# EasyEDA Pro project solorTraker.eprj

# Schematic Schematic1
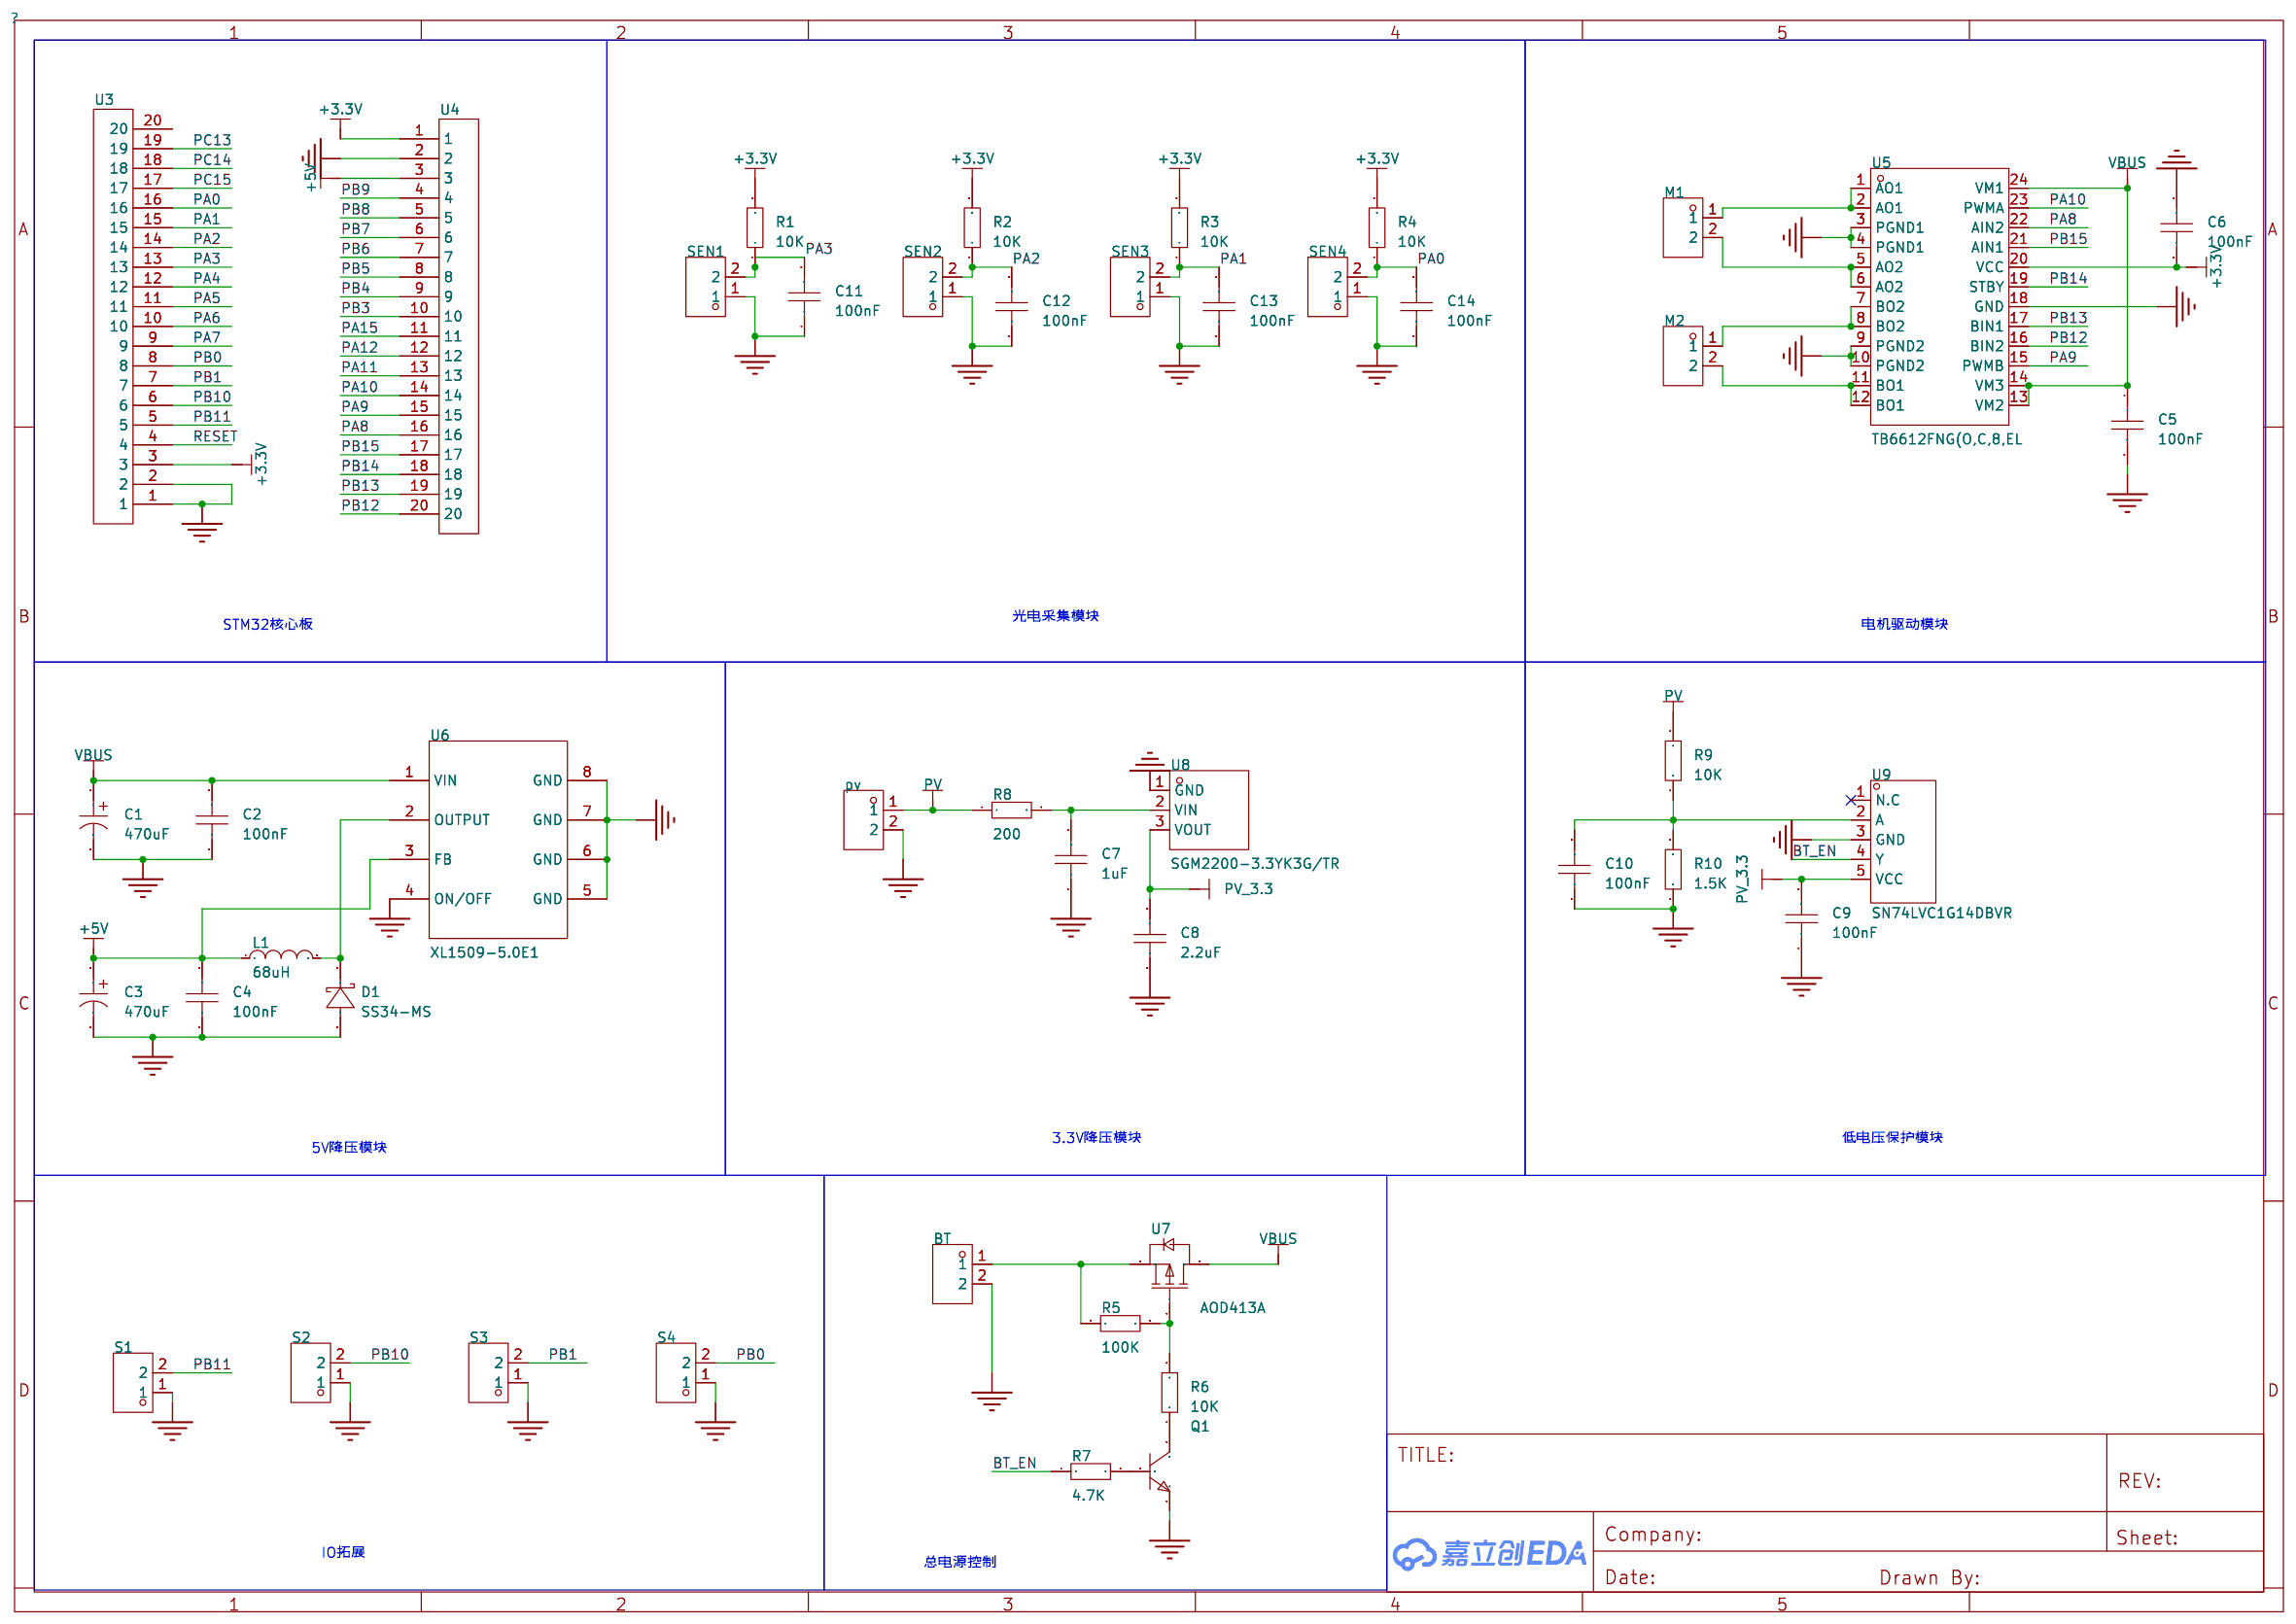
[diagram p0: schematic sheet]

## Parts
BT  KF350-3.5-2P  [CONN-TH_P3.50_KF350-3.5-2P]
C1  470uF  [CAP-SMD_BD10.0-L10.3-W10.3-LS11.0-FD]
C2  100nF  [C0603]
C3  470uF  [CAP-SMD_BD6.3-L6.6-W6.6-LS7.6-RD]
C4  100nF  [C0603]
C5  100nF  [C0603]
C6  100nF  [C0603]
C7  1uF  [C0603]
C8  2.2uF  [C0603]
C9  100nF  [C0603]
C10  100nF  [C0603]
C11  100nF  [C0603]
C12  100nF  [C0603]
C13  100nF  [C0603]
C14  100nF  [C0603]
D1  SS34-MS  [DO-214AC_L4.3-W2.7-LS5.0-RD]
L1  68uH  [IND-SMD_L11.5-W10.0_104CDMCCDS]
M1  ZX-XH2.54-2PZZ  [CONN-TH_2P-P2.50_HX25003-2A]
M2  ZX-XH2.54-2PZZ  [CONN-TH_2P-P2.50_HX25003-2A]
pv  ZX-XH2.54-2PZZ  [CONN-TH_2P-P2.50_HX25003-2A]
Q1  -  [S8050_SOT-23]
R1  10K  [R0603]
R2  10K  [R0603]
R3  10K  [R0603]
R4  10K  [R0603]
R5  100K  [R0603]
R6  10K  [R0603]
R7  4.7K  [R0603]
R8  200  [R0805]
R9  10K  [R0603]
R10  1.5K  [R0603]
S1  ZX-XH2.54-2PZZ  [CONN-TH_2P-P2.50_HX25003-2A]
S2  ZX-XH2.54-2PZZ  [CONN-TH_2P-P2.50_HX25003-2A]
S3  ZX-XH2.54-2PZZ  [CONN-TH_2P-P2.50_HX25003-2A]
S4  ZX-XH2.54-2PZZ  [CONN-TH_2P-P2.50_HX25003-2A]
SEN1  ZX-XH2.54-2PZZ  [CONN-TH_2P-P2.50_HX25003-2A]
SEN2  ZX-XH2.54-2PZZ  [CONN-TH_2P-P2.50_HX25003-2A]
SEN3  ZX-XH2.54-2PZZ  [CONN-TH_2P-P2.50_HX25003-2A]
SEN4  ZX-XH2.54-2PZZ  [CONN-TH_2P-P2.50_HX25003-2A]
U3  -  [HDR1X20]
U4  -  [HDR1X20]
U5  TB6612FNG(O,C,8,EL  [SSOP-24_L8.4-W5.8-P0.65-LS7.8-BL]
U6  XL1509-5.0E1  [SOIC-8_L5.0-W4.0-P1.27-LS6.0-BL]
U7  AOD413A  [TO-252-2_L6.6-W6.1-P4.58-LS10.1-BR-CW]
U8  SGM2200-3.3YK3G/TR  [SOT-89-3_L4.5-W2.5-P1.50-LS4.2-BR]
U9  SN74LVC1G14DBVR  [SOT-23-5_L3.0-W1.7-P0.95-LS2.8-BR]

## Library data of the parts
BT = KF350-3.5-2P: 结构:1x2P;间距:3.5mm;颜色:绿色;安装方式:直插;额定电流:10A;额定电压:300V;排数:1;线规 - AWG:18~24;线规 - 平方毫米:0.75;每排PIN数:2;工作温度范围:-40℃~+105℃;; LCSC Part Name: 3.5mm 1x2P 排数:1 每排P数:2 直插; Supplier Part: C474892; Manufacturer: KEFA(科发); Supplier Footprint: 插件,P=3.5mm; JLCPCB Part Class: 扩展库; Datasheet: https://atta.szlcsc.com/upload/public/pdf/source/20230317/986DB56DD49619EA586AA8816AA9D164.pdf; Supplier: LCSC; Structure: 1x2P; Pitch: 3.5mm; Color: 绿色; Mounting Style: 直插; Current Rating (Max): 10A; Voltage Rating (Max): 300V; Number of Pins: 2P; Number of Rows: 1; Wire Gauge - AWG: 18~24; Wire Gauge - mm2: 0.75; Number of PINs Per Row: 2; Operating Temperature Range: -40℃~+105℃
C1 = RVT470UF35V67RV0056: 容值:470uF;精度:±20%;额定电压:35V;纹波电流:286mA@120Hz;等效串联电阻:-;; LCSC Part Name: 470uF ±20% 35V; Supplier Part: C2836436; Manufacturer: KNSCHA(科尼盛); Supplier Footprint: SMD,D10xL10.2mm; JLCPCB Part Class: 扩展库; Datasheet: https://atta.szlcsc.com/upload/public/pdf/source/20210528/C2836436_C8D3EEA5E3C1CA7F9FA48FC22CF12531.pdf; Supplier: LCSC; Tolerance: ±20%; Rated Voltage: 35V; Ripple Current: 286mA@120Hz; φD: 10mm; L: 10.2mm; Lifetime @ Temp: 2000hrs@105℃; Operating Temperature: -55℃~+105℃
C2 C4-C14 = CAP_0603: Supplier Footprint: 0603
C3 = RVT1C471M0607: 容值:470uF;精度:±20%;额定电压:16V;纹波电流:185mA@120Hz;; LCSC Part Name: 470uF ±20% 16V; Supplier Part: C2977552; Manufacturer: ROQANG(容强); Supplier Footprint: SMD,D6.3xL7.7mm; JLCPCB Part Class: 扩展库; Datasheet: https://atta.szlcsc.com/upload/public/pdf/source/20220223/DD822675CC1DF2F0C06D5C2255C9C2D9.pdf; Supplier: LCSC; Tolerance: ±20%; Rated Voltage: 16V; Ripple Current: 185mA@120Hz; φD: 6.3mm; L: 7.7mm; Lifetime @ Temp: 2000hrs@105℃; Operating Temperature: -40℃~+105℃
D1 = SS34-MS: 二极管配置:-;正向压降(Vf):550mV@3A;直流反向耐压(Vr):40V;平均整流电流(Io):3A;; LCSC Part Name: 电压:40V 电流:3A; Supplier Part: C2836396; Manufacturer: MSKSEMI(美森科); Supplier Footprint: SMA(DO-214AC); JLCPCB Part Class: 扩展库; Datasheet: https://atta.szlcsc.com/upload/public/pdf/source/20231010/B8429D209A8A83BAE11971393C9E7848.pdf; Supplier: LCSC; Forward Voltage (Vf@If): 550mV@3A; Reverse Voltage (Vr): 40V; Average Rectified Current (Io): 3A; Reverse Leakage Current (Ir): 500uA@40V
L1 = FXL1040-680-M: 电感值:68uH;精度:±20%;额定电流:2.5A;饱和电流(Isat):3A;类型:一体成型电感;; LCSC Part Name: 68uH ±20% 3A; Supplier Part: C475920; Manufacturer: cjiang(长江微电); Supplier Footprint: SMD,11.5x10mm; JLCPCB Part Class: 扩展库; Datasheet: https://atta.szlcsc.com/upload/public/pdf/source/20230516/54757DC4DB76FADFA619F78143C06647.pdf; Supplier: LCSC; Tolerance: ±20%; Rated Current: 2.5A; Saturation Current (Isat): 3A; DC Resistance (DCR): 195mΩ; Type: 一体成型电感
M1 M2 pv S1-S4 SEN1-SEN4 = ZX-XH2.54-2PZZ: 插针结构:1x2P;间距:2.54mm;安装方式:直插;参考系列:XH;总PIN数:2P;排数:1;每排PIN数:2;行距:-;额定电流:3A;触头材质:黄铜;触头镀层:锡;工作温度范围:-25℃~+85℃;; Supplier Part: C7429632; Manufacturer: Megastar(兆星); Supplier Footprint: 插件,P=2.54mm; JLCPCB Part Class: 扩展库; Datasheet: https://atta.szlcsc.com/upload/public/pdf/source/20230619/19BA6947230AA44A04D3EDD65E618FD0.pdf; Supplier: LCSC; Pins Structure: 1x2P; Pitch: 2.54mm; Mounting Style: 直插; Reference Series: XH; Number of Pins: 2P; Number of Rows: 1; Number of PINs Per Row: 2; Current Rating (Max): 3A; Contact Material: 黄铜; Contact Plating: 锡; Operating Temperature Range: -25℃~+85℃
Q1 = S8050_SOT_NPN: Supplier Footprint: SOT-23
R1-R7 R9 R10 = Res_0603: Supplier Footprint: 0603
R8 = Res_0805: Supplier Footprint: 0805
U3 U4 = 1X20
U5 = TB6612FNG(O,C,8,EL: 双直流电机驱动器集成电路; Supplier Part: C88224; Manufacturer: TOSHIBA(东芝); Supplier Footprint: SSOP-24-208mil; JLCPCB Part Class: 扩展库; Datasheet: https://atta.szlcsc.com/upload/public/pdf/source/20171128/C141517_15118625624231147036.pdf; Supplier: LCSC
U6 = XL1509-5.0E1: 功能类型:降压型;输入电压:-;输出电流(最大值):-;; Supplier Part: C61063; Manufacturer: XLSEMI(芯龙); Supplier Footprint: SOIC-8; JLCPCB Part Class: 基础库; Datasheet: https://atta.szlcsc.com/upload/public/pdf/source/20151126/1457707596805.pdf; Supplier: LCSC; Function: 降压型; Switch tube (built-in/external): 内置
U7 = AOD413A_C5261059: 类型:P沟道;漏源电压(Vdss):40V;连续漏极电流(Id):25A;功率(Pd):8W;导通电阻(RDS(on)@Vgs,Id):44mΩ@4.5V;阈值电压(Vgs(th)@Id):2.5V@250uA;; LCSC Part Name: P沟道 耐压:40V 电流:25A; Supplier Part: C5261059; Manufacturer: HXY MOSFET(华轩阳电子); Supplier Footprint: TO-252-2L; JLCPCB Part Class: 扩展库; Datasheet: https://atta.szlcsc.com/upload/public/pdf/source/20221111/DEFC72396C0221D22120D4BE27CE7200.pdf; Supplier: LCSC; Type: P沟道; Drain Source Voltage (Vdss): 40V; Continuous Drain Current (Id): 25A; Power Dissipation (Pd): 8W; Drain Source On Resistance (RDS(on)@Vgs,Id): 44mΩ@4.5V; Gate Threshold Voltage (Vgs(th)@Id): 2.5V@250uA; Input Capacitance (Ciss@Vds): 1.034nF
U8 = SGM2200-3.3YK3G/TR: Supplier Part: C80929; Manufacturer: SGMICRO(圣邦微); Supplier Footprint: SOT-89-3; JLCPCB Part Class: Extended Part; Datasheet: https://atta.szlcsc.com/upload/public/pdf/source/20180326/C80929_E236534340D5DB25B3096B98A8E77889.pdf; Supplier: LCSC
U9 = SN74LVC1G14DBVR: 输入类型:施密特触发器;电源电压:1.65V~5.5V;供电电流(最大值):10uA;电路数:1;最大传播延迟(tpd):6.5ns@2.5V,50pF;; LCSC Part Name: 单路施密特触发反相器; Supplier Part: C7835; Manufacturer: TI(德州仪器); Supplier Footprint: SOT-23-5; JLCPCB Part Class: 扩展库; Datasheet: https://www.ti.com/cn/lit/gpn/sn74lvc1g14; Supplier: LCSC; Input Type: 施密特触发器; Supply Voltage(Single): 1.65V~5.5V; Supply Current (Max): 10uA; Number of Circuits: 1; Number of Inputs: 1; Sink Current: 32mA; Source Current: 32mA; High level range (VIH): 1.16V~3.33V; Low level range (VIL): 390mV~1.87V; Max Propagation Delay: 6.5ns@2.5V,50pF; Series: 74LVC系列; Operating Temperature: -40℃~+125℃

## Nets
+3.3V: C6.2 R1.2 R2.2 R3.2 R4.2 U3.3 U4.1 U5.20(VCC)
+5V: C3.1 C4.2 L1.1 U4.3 U6.3(FB)
GND: BT.2 C1.2 C2.1 C3.2 C4.1 C5.2 C6.1 C7.1 C8.1 C9.1 C10.1 C11.1 C12.1 C13.1 C14.1 D1.2(K) pv.2 Q1.2 R10.1 S1.1 S2.1 S3.1 S4.1 SEN1.1 SEN2.1 SEN3.1 SEN4.1 U3.1 U3.2 U4.2 U5.3(PGND1) U5.4(PGND1) U5.9(PGND2) U5.10(PGND2) U5.18(GND) U6.4(ON/OFF) U6.5(GND) U6.6(GND) U6.7(GND) U6.8(GND) U8.1(GND) U9.3(GND)
VBUS: C1.1 C2.2 C5.1 U5.13(VM2) U5.14(VM3) U5.24(VM1) U6.1(VIN) U7.2(D)
BT_EN: R7.1 U9.4(Y)
PA0: C14.2 R4.1 SEN4.2 U3.16
PA1: C13.2 R3.1 SEN3.2 U3.15
PA2: C12.2 R2.1 SEN2.2 U3.14
PA3: C11.2 R1.1 SEN1.2 U3.13
PA4: U3.12
PA5: U3.11
PA6: U3.10
PA7: U3.9
PA8: U4.16 U5.22(AIN2)
PA9: U4.15 U5.15(PWMB)
PA10: U4.14 U5.23(PWMA)
PA11: U4.13
PA12: U4.12
PA15: U4.11
PB0: S4.2 U3.8
PB1: S3.2 U3.7
PB3: U4.10
PB4: U4.9
PB5: U4.8
PB6: U4.7
PB7: U4.6
PB8: U4.5
PB9: U4.4
PB10: S2.2 U3.6
PB11: S1.2 U3.5
PB12: U4.20 U5.16(BIN2)
PB13: U4.19 U5.17(BIN1)
PB14: U4.18 U5.19(STBY)
PB15: U4.17 U5.21(AIN1)
PC13: U3.19
PC14: U3.18
PC15: U3.17
PV: pv.1 R8.1 R9.2
PV_3.3: C8.2 C9.2 U8.3(VOUT) U9.5(VCC)
RESET: U3.4
$1N1324: D1.1(A) L1.2 U6.2(OUTPUT)
$1N3584: Q1.3 R6.1
$1N3642: Q1.1 R7.2
$1N3830: C7.2 R8.2 U8.2(VIN)
$1N4256: C10.2 R9.1 R10.2 U9.2(A)
$1N4276: R5.2 R6.2 U7.1(G)
$1N4431: BT.1 R5.1 U7.3(S)
$1N4492: M1.2 U5.5(AO2) U5.6(AO2)
$1N4493: M1.1 U5.1(AO1) U5.2(AO1)
$1N4500: M2.2 U5.11(BO1) U5.12(BO1)
$1N4501: M2.1 U5.7(BO2) U5.8(BO2)

Not connected (* = marked no-connect by the designer): U3 20; U9 1(N.C)*

## Notes on the sheet
- 光电采集模块
- STM32核心板
- 电机驱动模块
- 3.3V降压模块
- 低电压保护模块
- 5V降压模块
- IO拓展
- 总电源控制

# Board PCB1
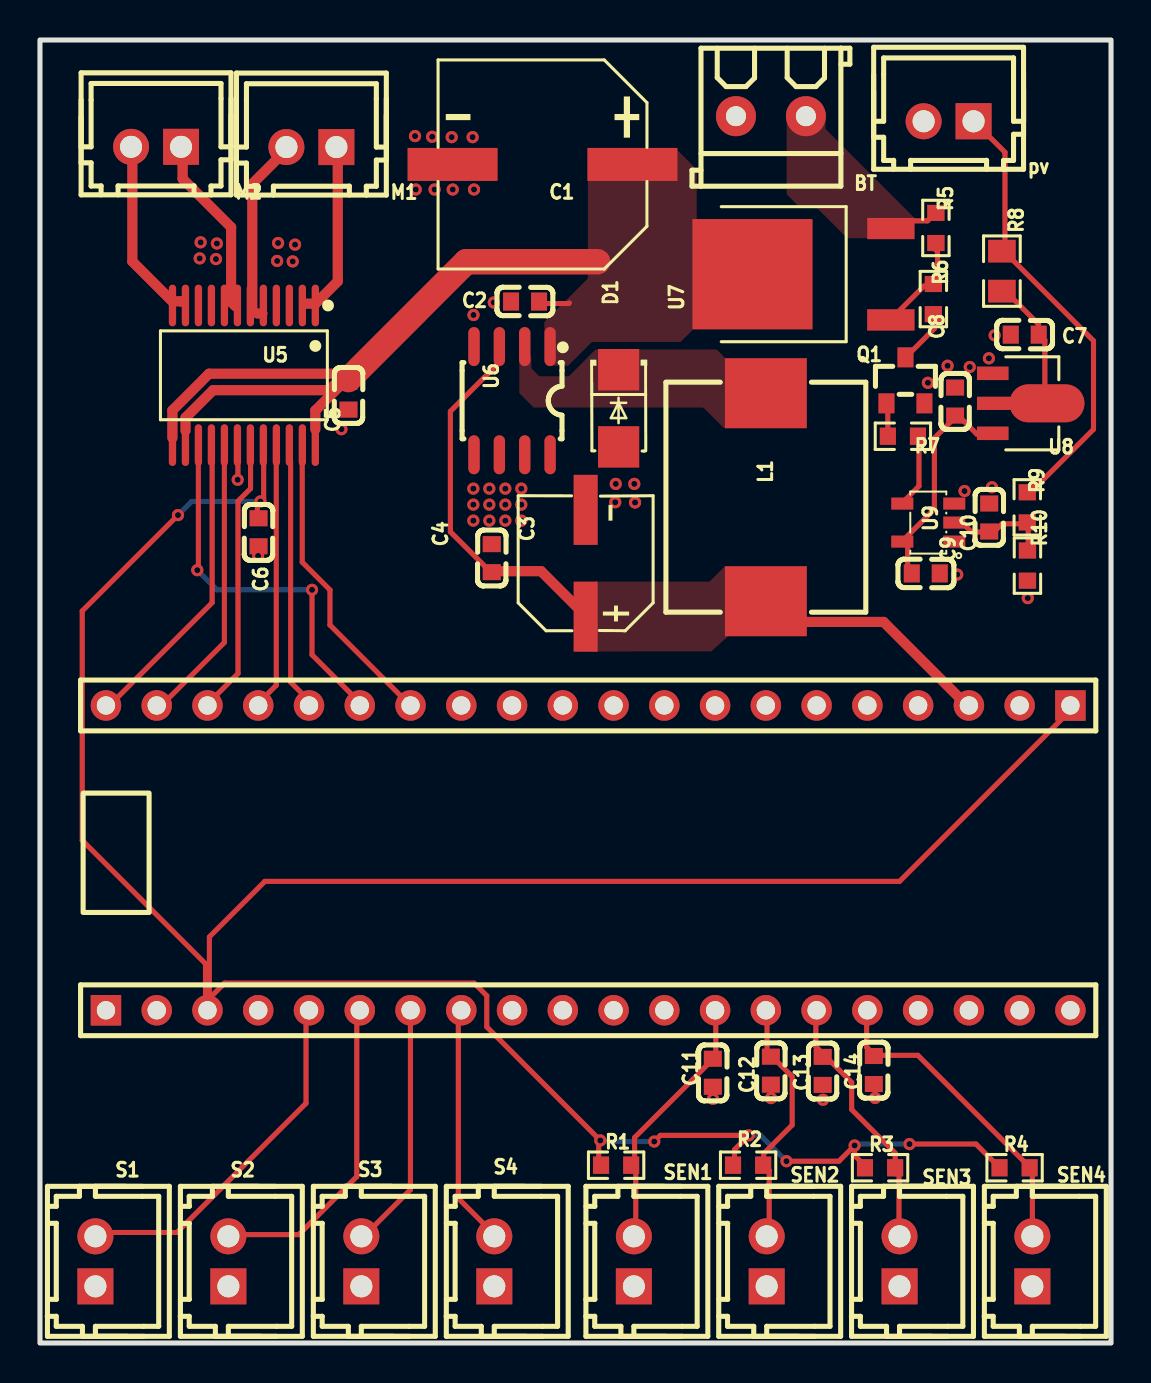
[diagram p1: board, top side]
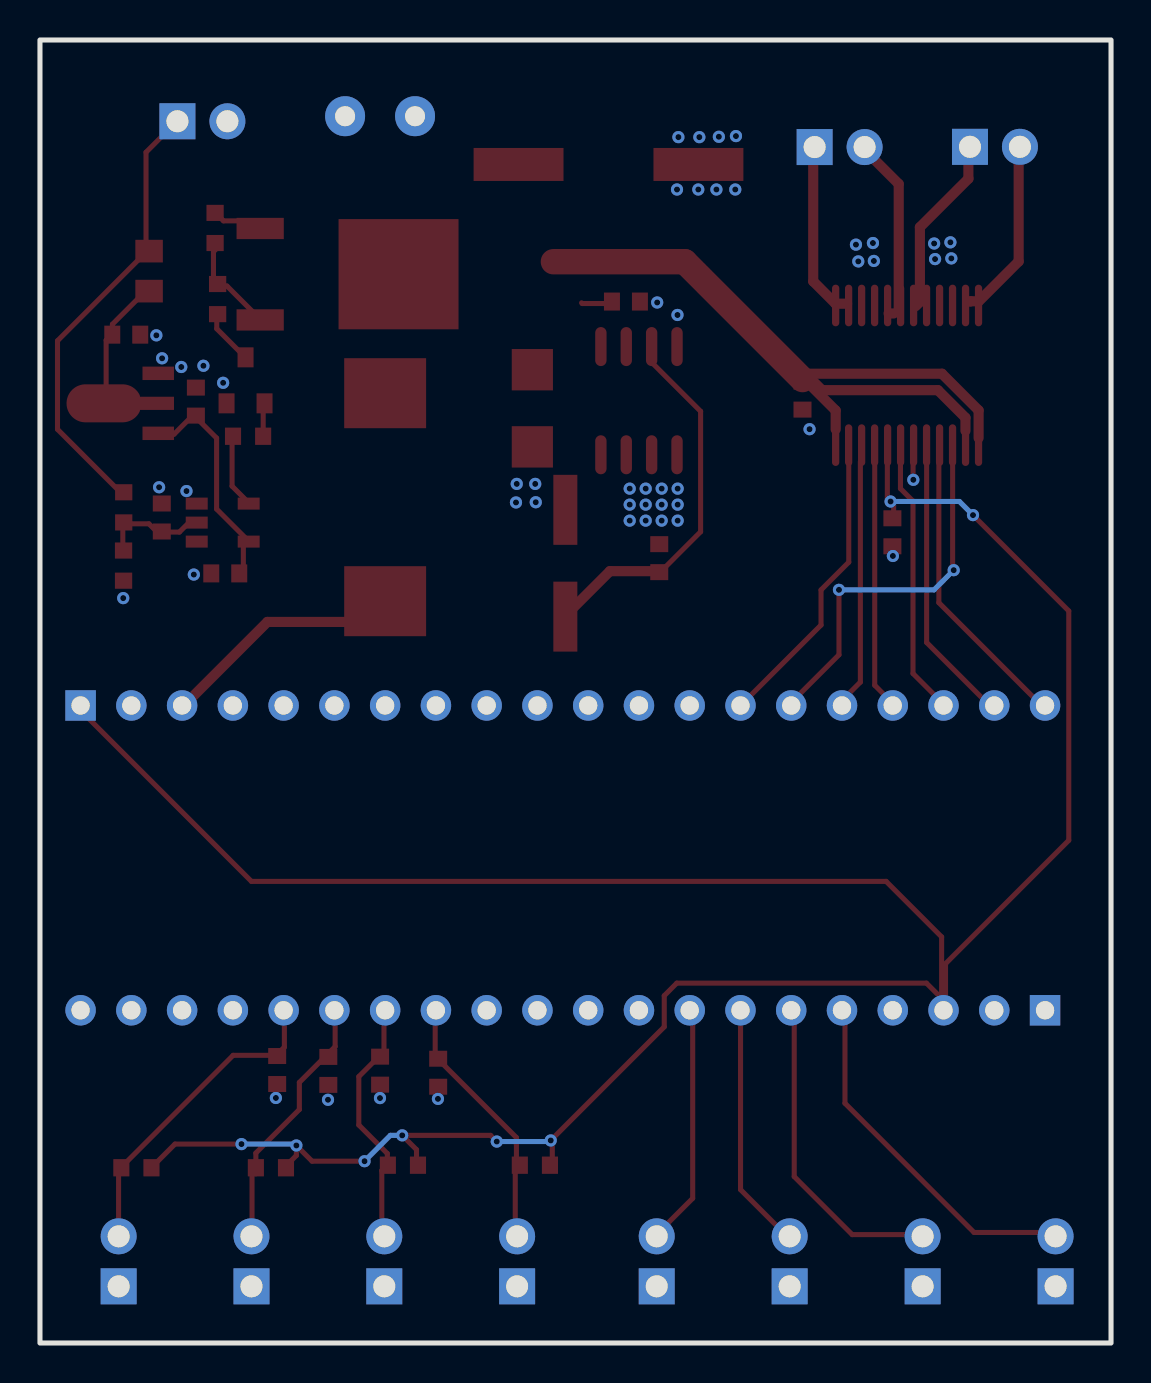
[diagram p2: board, bottom side, seen from below]

Outline 53.59 x 65.15 mm; copper layers: Top Layer, Bottom Layer. Coordinates in mm from the lower left corner of the outline.
Outline path: rectangle 0,65.15 53.59,0
Stack: Top Layer 0.035mm / Dielectric1 1.51mm FR4 er 4.5 / Bottom Layer 0.035mm

## Design rules (mm)
template: 自定义配置
spacing copperThickness1oz (default): track to track 0.102, other pairs 0.152 to 0.3
spacing copperThickness2oz: track to track 0.203, other pairs 0.152 to 0.3
track width copperThickness1oz (default): min 0.127, default 0.254, max 2.54
track width copperThickness2oz: min 0.203, default 0.254, max 2.54
differential pair differentialPair (default): width min 0.127, default 0.254, max 2.54; gap min 0.152, default 0.152
via viaSize (default): diameter min 0.5, default 0.61, max 10; hole min 0.3, default 0.305, max 6.3

## Placement (name value [footprint] x y rotation side)
BT  KF350-3.5-2P  [CONN-TH_P3.50_KF350-3.5-2P]  36.58 61.34 180 top
C1  470uF  [CAP-SMD_BD10.0-L10.3-W10.3-LS11.0-FD]  25.15 58.93 180 top
C2  100nF  [C0603]  24.27 52.07 0 top
C3  470uF  [CAP-SMD_BD6.3-L6.6-W6.6-LS7.6-RD]  27.31 38.99 90 top
C4  100nF  [C0603]  22.61 39.24 270 top
C5  100nF  [C0603]  15.44 47.37 270 top
C6  100nF  [C0603]  10.94 40.54 90 top
C7  1uF  [C0603]  49.28 50.42 0 top
C8  2.2uF  [C0603]  45.79 47.07 270 top
C9  100nF  [C0603]  44.32 38.48 180 top
C10  100nF  [C0603]  47.5 41.27 270 top
C11  100nF  [C0603]  33.67 13.51 90 top
C12  100nF  [C0603]  36.57 13.62 90 top
C13  100nF  [C0603]  39.16 13.6 90 top
C14  100nF  [C0603]  41.72 13.65 90 top
D1  SS34-MS  [DO-214AC_L4.3-W2.7-LS5.0-RD]  28.96 46.74 270 top
L1  68uH  [IND-SMD_L11.5-W10.0_104CDMCCDS]  36.32 42.29 90 top
M1  ZX-XH2.54-2PZZ  [CONN-TH_2P-P2.50_HX25003-2A]  13.58 59.8 180 top
M2  ZX-XH2.54-2PZZ  [CONN-TH_2P-P2.50_HX25003-2A]  5.81 59.81 180 top
pv  ZX-XH2.54-2PZZ  [CONN-TH_2P-P2.50_HX25003-2A]  45.47 61.09 180 top
Q1  -  [S8050_SOT-23]  43.18 48.13 270 top
R1  10K  [R0603]  28.83 8.89 180 top
R2  10K  [R0603]  35.43 8.89 180 top
R3  10K  [R0603]  42.04 8.76 180 top
R4  10K  [R0603]  48.77 8.76 180 top
R5  100K  [R0603]  44.83 55.75 270 top
R6  10K  [R0603]  44.7 52.2 90 top
R7  4.7K  [R0603]  43.18 45.34 180 top
R8  200  [R0805]  48.13 53.59 270 top
R9  10K  [R0603]  49.4 41.78 90 top
R10  1.5K  [R0603]  49.41 38.87 90 top
S1  ZX-XH2.54-2PZZ  [CONN-TH_2P-P2.50_HX25003-2A]  2.77 4.08 90 top
S2  ZX-XH2.54-2PZZ  [CONN-TH_2P-P2.50_HX25003-2A]  9.43 4.08 90 top
S3  ZX-XH2.54-2PZZ  [CONN-TH_2P-P2.50_HX25003-2A]  16.08 4.08 90 top
S4  ZX-XH2.54-2PZZ  [CONN-TH_2P-P2.50_HX25003-2A]  22.73 4.08 90 top
SEN1  ZX-XH2.54-2PZZ  [CONN-TH_2P-P2.50_HX25003-2A]  29.72 4.08 90 top
SEN2  ZX-XH2.54-2PZZ  [CONN-TH_2P-P2.50_HX25003-2A]  36.36 4.08 90 top
SEN3  ZX-XH2.54-2PZZ  [CONN-TH_2P-P2.50_HX25003-2A]  43.01 4.08 90 top
SEN4  ZX-XH2.54-2PZZ  [CONN-TH_2P-P2.50_HX25003-2A]  49.66 4.08 90 top
U3  -  [HDR1X20]  27.43 16.64 0 top
U4  -  [HDR1X20]  27.43 31.88 180 top
U5  TB6612FNG(O,C,8,EL  [SSOP-24_L8.4-W5.8-P0.65-LS7.8-BL]  10.2 48.39 180 top
U6  XL1509-5.0E1  [SOIC-8_L5.0-W4.0-P1.27-LS6.0-BL]  23.62 47.12 180 top
U7  AOD413A  [TO-252-2_L6.6-W6.1-P4.58-LS10.1-BR-CW]  39.11 53.44 0 top
U8  SGM2200-3.3YK3G/TR  [SOT-89-3_L4.5-W2.5-P1.50-LS4.2-BR]  49.03 46.98 180 top
U9  SN74LVC1G14DBVR  [SOT-23-5_L3.0-W1.7-P0.95-LS2.8-BR]  44.45 41.02 0 top

## Footprints (pads in the part's own frame, mm; a bottom-side part is the same pattern mirrored in y, then rotated)
C0603
  rect 0.8x0.9 smd: 1(-0.7,0) 2(0.7,0)
CAP-SMD_BD6.3-L6.6-W6.6-LS7.6-RD
  rect 3.5x1.2 smd: 1(-2.67,0) 2(2.67,0)
CAP-SMD_BD10.0-L10.3-W10.3-LS11.0-FD
  rect 4.5x1.65 smd: 1(-4.5,0) 2(4.5,0)
CONN-TH_2P-P2.50_HX25003-2A
  rect 1.8x1.8 hole 1.1: 1(-1.25,0)
  round 1.8 hole 1.1: 2(1.25,0)
CONN-TH_P3.50_KF350-3.5-2P
  round 2 hole 1: 1(-1.75,0) 2(1.75,0)
DO-214AC_L4.3-W2.7-LS5.0-RD
  rect 2.07x2.06 smd: 1(-1.929,0) 2(1.929,0)
HDR1X20
  rect 1.524x1.524 hole 0.914: 1(-24.13,0)
  round 1.524 hole 0.914: 2(-21.59,0) 3(-19.05,0) 4(-16.51,0) 5(-13.97,0) 6(-11.43,0) 7(-8.89,0) 8(-6.35,0) 9(-3.81,0) 10(-1.27,0) 11(1.27,0) 12(3.81,0) 13(6.35,0) 14(8.89,0) 15(11.43,0) 16(13.97,0) 17(16.51,0) 18(19.05,0) 19(21.59,0) 20(24.13,0)
IND-SMD_L11.5-W10.0_104CDMCCDS
  rect 3.5x4.1 smd: 1(-5.2,0) 2(5.2,0)
R0603
  rect 0.806x0.864 smd: 1(-0.753,0) 2(0.753,0)
R0805
  rect 1.133x1.377 smd: 1(-1,0) 2(1,0)
S8050_SOT-23
  rect 1x0.8 smd: 1(1.15,-0.823) 2(1.15,1.077) 3(-1.15,0.127)
SOIC-8_L5.0-W4.0-P1.27-LS6.0-BL
  oval 0.569x1.95 smd: 1(-1.905,-2.705) 2(-0.635,-2.705) 3(0.635,-2.705) 4(1.905,-2.705) 5(1.905,2.705) 6(0.635,2.705) 7(-0.635,2.705) 8(-1.905,2.705)
SOT-23-5_L3.0-W1.7-P0.95-LS2.8-BR
  rect 1.1x0.6 smd: 1(1.3,-0.95) 2(1.3,0) 3(1.3,0.95) 4(-1.3,0.95) 5(-1.3,-0.95)
SOT-89-3_L4.5-W2.5-P1.50-LS4.2-BR
  rect 1.575x0.672 smd: 1(1.356,-1.5) 3(1.356,1.5)
  custom 5.377x1.9 smd: 2(-1.356,0)
SSOP-24_L8.4-W5.8-P0.65-LS7.8-BL
  oval 0.364x2.082 smd: 1(-3.575,-3.491) 2(-2.925,-3.491) 3(-2.275,-3.491) 4(-1.625,-3.491) 5(-0.975,-3.491) 6(-0.325,-3.491) 7(0.325,-3.491) 8(0.975,-3.491) 9(1.625,-3.491) 10(2.275,-3.491) 11(2.925,-3.491) 12(3.575,-3.491) 13(3.575,3.491) 14(2.925,3.491) 15(2.275,3.491) 16(1.625,3.491) 17(0.975,3.491) 18(0.325,3.491) 19(-0.325,3.491) 20(-0.975,3.491) 21(-1.625,3.491) 22(-2.275,3.491) 23(-2.925,3.491) 24(-3.575,3.491)
TO-252-2_L6.6-W6.1-P4.58-LS10.1-BR-CW
  rect 2.364x1.064 smd: 1(3.462,-2.286) 3(3.462,2.286)
  rect 6.004x5.512 smd: 2(-3.462,0)

## Nets
As in the schematic.

Pads without a net: U3 20; U9 1

## Via types
v1: diameter 0.61, hole 0.305, Top Layer to Bottom Layer, 60 vias

## Routing (per net, layer and track width the routed paths; a pad name or vN(x,y) marks a point on that pad's centre or on a via; arc(x,y) is an arc through that point)
+3.3V: length 137.1
  Top Layer w0.254: 51.67,31.74 43.01,23.08 11.25,23.08 8.48,20.31 8.48,17.03 ; 34.75,9 34.75,9.67 v1(35.47,10.38) 31.05,10.38 v1(30.74,10.07) ; v1(37.35,9.09) 39.98,9.09 v1(40.76,9.88) 40.76,9.38 41.24,8.9 ; 8.5,17.26 9.24,17.99 21.73,17.99 22.36,17.37 22.36,15.81 v1(28.04,10.13) ; 27.96,9.12 27.96,10.05 27.98,10.07 ; 47.94,8.84 46.84,9.95 v1(43.51,9.95) ; 8.28,16.57 8.28,18.96 2.11,25.13 2.11,36.6 v1(6.91,41.4) ; 10.88,41.25 10.88,41.9 11.19,42.21 11.19,44.06
  Bottom Layer w0.254: v1(43.51,9.95) 40.83,9.95 v1(40.76,9.88) ; v1(30.74,10.07) 28.09,10.07 v1(28.04,10.13) ; v1(11.03,42.08) 7.59,42.08 v1(6.91,41.4) ; v1(35.47,10.38) 36.06,10.38 v1(37.35,9.09)
+5V: length 28.7
  Top Layer w0.254: 23.1,49.32 23.1,49.15 20.54,46.58 20.54,40.56 22.62,38.48
  Top Layer w0.508: 27.14,36.53 25.08,38.59 22.58,38.59 ; 37.74,36.05 42.21,36.05 46.5,31.77
GND: length 0.9
  Top Layer w0.254: 9.9,44.01 9.9,43.17 v1(9.89,43.16)
  vias: v1(8.04,55.03) v1(7.99,54.23) v1(8.81,54.2) v1(8.85,54.98) v1(10.91,39.35) v1(11.91,55) v1(11.87,54.1) v1(12.65,54.08) v1(12.76,54.92) v1(15.09,45.69) v1(18.77,60.35) v1(18.8,57.68) v1(19.62,60.31) v1(19.75,57.68) v1(20.6,60.29) v1(20.65,57.68) v1(21.65,60.29) v1(21.72,57.68) v1(21.69,51.4) v1(21.69,42.72) v1(21.69,41.92) v1(21.69,41.12) v1(22.48,42.72) v1(22.48,41.92) v1(22.48,41.12) v1(22.71,52.03) v1(23.28,42.72) v1(23.28,41.92) v1(23.28,41.12) v1(24.09,42.72) v1(24.09,41.92) v1(24.09,41.12) v1(28.81,42.96) v1(28.79,42.04) v1(29.74,42.96) v1(29.78,42.03) v1(33.68,12.21) v1(36.58,12.25) v1(39.18,12.16) v1(41.79,12.25) v1(44.43,48.01) v1(45.42,48.86) v1(45.9,38.42) v1(46.26,42.6) v1(46.52,48.8) v1(47.48,49.24) v1(47.63,42.79) v1(47.77,50.38) v1(49.43,37.24)
VBUS: length 38.8
  Top Layer w0.254: 25.28,51.97 26.46,51.97 26.49,52.01
  Top Layer w0.508: 13.78,45.68 13.78,46.63 15.09,47.94 ; 6.63,45.25 6.63,46.63 8.46,48.46 15.19,48.46 15.25,48.41 ; 7.28,45.61 7.28,46.27 8.66,47.64 14.46,47.64 14.97,48.15
  Top Layer w1.27: 27.9,54.06 21.33,54.06 15.44,48.17
BT_EN: length 3.5
  Top Layer w0.254: 43.19,42.05 43.98,42.84 43.98,45.23
PA0: length 15.6
  Top Layer w0.254: 49.66,5.5 49.66,8.62 49.7,8.66 ; 41.36,16.66 41.36,14.79 41.78,14.38 43.93,14.38 49.44,8.87
PA1: length 13.4
  Top Layer w0.254: 42.98,8.81 42.98,5.36 42.87,5.25 ; 38.82,16.61 38.82,14.82 40.61,13.03 40.61,11.67 42.79,9.5 42.79,8.46
PA2: length 12.1
  Top Layer w0.254: 36.31,8.81 36.49,8.62 36.49,5.54 ; 36.21,8.92 36.21,9.47 37.64,10.9 37.64,13.32 36.38,14.58 36.38,16.56
PA3: length 13.1
  Top Layer w0.254: 29.67,8.77 29.81,8.62 29.81,5.32 ; 33.82,16.61 33.82,14.34 29.75,10.27 29.75,8.75
PA8: length 12.2
  Top Layer w0.254: 12.54,44.07 12.54,33.04 13.4,32.18
PA9: length 18.3
  Top Layer w0.254: 7.93,44.16 7.93,38.7 v1(7.87,38.64) ; v1(13.61,37.66) 13.61,34.41 16.02,32
  Bottom Layer w0.254: v1(13.61,37.66) 8.86,37.66 v1(7.87,38.64)
PA10: length 14.6
  Top Layer w0.254: 13.12,44.17 13.12,39.04 14.51,37.65 14.51,35.9 18.57,31.84
PB0: length 11.9
  Top Layer w0.254: 20.93,16.56 20.93,7.23 22.75,5.42
PB1: length 12.1
  Top Layer w0.254: 18.54,16.34 18.54,7.67 16.11,5.24
PB10: length 15.5
  Top Layer w0.254: 9.47,5.42 12.95,5.42 15.85,8.32 15.85,16.2
PB11: length 17.6
  Top Layer w0.254: 2.64,5.53 6.85,5.53 13.31,11.99 13.31,16.27
PB12: length 14.5
  Top Layer w0.254: 3.54,31.94 8.62,37.02 8.62,44.37
PB13: length 13.7
  Top Layer w0.254: 9.23,44.28 9.23,35.03 6.05,31.85
PB14: length 13.2
  Top Layer w0.254: 10.54,44.44 10.54,42.72 9.91,42.09 9.91,33.47 8.49,32.06
PB15: length 12.4
  Top Layer w0.254: 10.96,32.03 11.82,32.89 11.82,44.07
PV: length 22
  Top Layer w0.254: 46.91,60.92 48.29,59.54 48.29,54.89 ; 48.21,54.61 52.72,50.11 52.72,45.68 49.47,42.44
PV_3.3: length 10.9
  Top Layer w0.254: 45.97,46.36 46.88,45.44 47.82,45.44 ; 43.42,38.55 43.42,39.88 43.3,40 ; 45.72,46.21 44.76,45.25 44.76,41.7 43.19,40.13
$1N3584: length 2.5
  Top Layer w0.254: 43.42,49.38 44.75,50.71 44.75,51.37
$1N3642: length 1.6
  Top Layer w0.254: 42.45,47.04 42.42,47.01 42.42,45.46
$1N3830: length 6.2
  Top Layer w0.254: 49.97,50.48 49.97,50.94 48.23,52.68 ; 50.28,47.24 50.28,50.14 50.04,50.38
$1N4256: length 4.9
  Top Layer w0.254: 49.45,39.82 49.45,40.79 49.62,40.96 48.14,40.96 47.73,40.55 ; 46.12,41.04 46.61,40.55 47.59,40.55
$1N4276: length 4.5
  Top Layer w0.254: 44.77,54.71 44.91,54.57 44.91,52.92 ; 42.76,51.37 44.24,52.85 44.82,52.85
$1N4431: length 1.7
  Top Layer w0.254: 43.11,56.11 44.41,56.11 44.69,56.38
$1N4492: length 9.1
  Top Layer w0.508: 11.13,51.48 10.88,51.48 ; 10.62,51.55 10.62,57.95 12.32,59.65
$1N4493: length 8.6
  Top Layer w0.508: 14.9,59.54 14.9,53.08 13.78,51.97 13.21,51.97
$1N4500: length 8.8
  Top Layer w0.508: 6.61,52.09 4.62,54.08 4.62,59.65 ; 7.05,52.07 7.03,52.09 6.65,52.09
$1N4501: length 8.8
  Top Layer w0.508: 9.77,51.84 9.56,52.05 9.56,55.79 7.14,58.22 7.14,59.58

## Copper pours and planes (outline as drawn; the poured copper is in the pictures)
+5V on Top Layer: 27.53,38.83 34.66,38.83 34.66,34.58 27.53,34.58
GND on Top Layer: -1.95,68.23 54.3,68.23 54.3,-0.64 -1.95,-0.64
GND on Bottom Layer: -0.75,66.05 54.84,66.05 54.84,-1.04 -0.75,-1.04
VBUS on Top Layer: 25.23,59.72 32.86,59.72 32.86,48.86 25.23,48.86
$1N1324 on Top Layer: 23.98,49.67 33.81,49.67 33.81,46.25 23.98,46.25
$1N1324 on Top Layer: 33.05,49.67 34.37,49.67 34.37,45.74 33.05,45.74
$1N4431 on Top Layer: 37.37,61.56 43.76,61.56 43.76,55.24 37.37,55.24
